# Altium schematic sheet micron_P7.SchDoc
size A; SheetNumber: 7; SheetTotal: 11
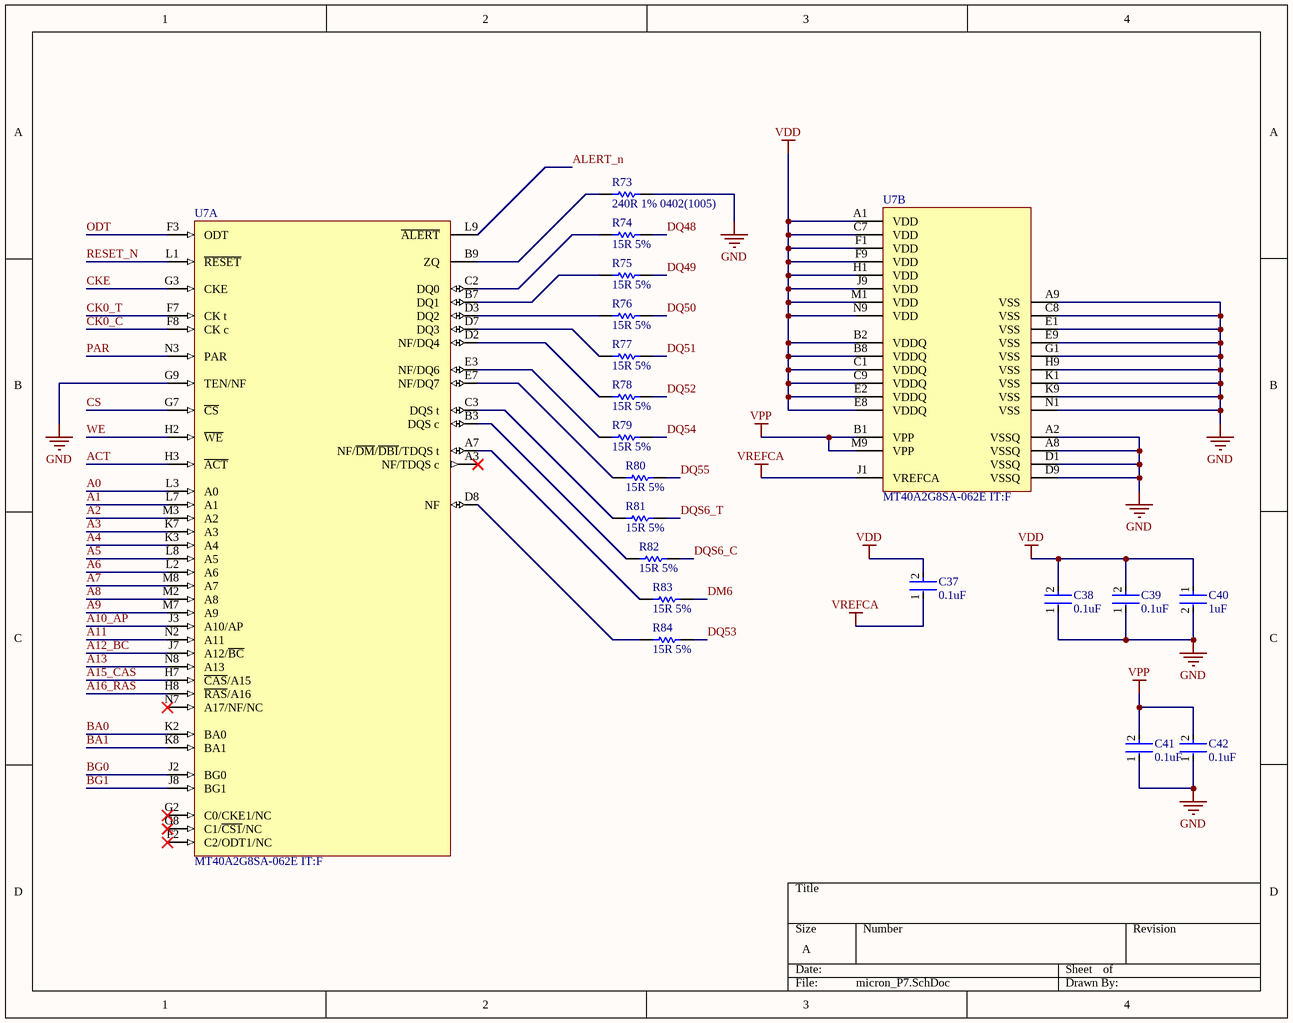
[diagram p0: micron_P7.SchDoc]

## Parts
C37  0.1uF  [FP-GRM15-MFG]
C38  0.1uF  [FP-GRM15-MFG]
C39  0.1uF  [FP-GRM15-MFG]
C40  1uF  [FP-CL511-IPC_C]
C41  0.1uF  [FP-GRM15-MFG]
C42  0.1uF  [FP-GRM15-MFG]
R73  240R 1% 0402(1005)  [RESC0402(1005)_L]
R74  15R 5%  [RESC1005X40X25LL05T10]
R75  15R 5%  [RESC1005X40X25LL05T10]
R76  15R 5%  [RESC1005X40X25LL05T10]
R77  15R 5%  [RESC1005X40X25LL05T10]
R78  15R 5%  [RESC1005X40X25LL05T10]
R79  15R 5%  [RESC1005X40X25LL05T10]
R80  15R 5%  [RESC1005X40X25LL05T10]
R81  15R 5%  [RESC1005X40X25LL05T10]
R82  15R 5%  [RESC1005X40X25LL05T10]
R83  15R 5%  [RESC1005X40X25LL05T10]
R84  15R 5%  [RESC1005X40X25LL05T10]
U7  MT40A2G8SA-062E IT:F  [SA_MFG]  (parts A,B of 2)

## Nets
GND: C38.1 C39.1 C40.2 C41.1 C42.1 R73.2 U7.A2(VSSQ) U7.A8(VSSQ) U7.A9(VSS) U7.C8(VSS) U7.D1(VSSQ) U7.D9(VSSQ) U7.E1(VSS) U7.E9(VSS) U7.G1(VSS) U7.G9(TEN/NF) U7.H9(VSS) U7.K1(VSS) U7.K9(VSS) U7.N1(VSS)
VDD: C37.2 C38.2 C39.2 C40.1 U7.A1(VDD) U7.B2(VDDQ) U7.B8(VDDQ) U7.C1(VDDQ) U7.C7(VDD) U7.C9(VDDQ) U7.E2(VDDQ) U7.E8(VDDQ) U7.F1(VDD) U7.F9(VDD) U7.H1(VDD) U7.J9(VDD) U7.M1(VDD) U7.N9(VDD)
VPP: C41.2 C42.2 U7.B1(VPP) U7.M9(VPP)
VREFCA: C37.1 U7.J1(VREFCA)
A0: U7.L3(A0)
A1: U7.L7(A1)
A2: U7.M3(A2)
A3: U7.K7(A3)
A4: U7.K3(A4)
A5: U7.L8(A5)
A6: U7.L2(A6)
A7: U7.M8(A7)
A8: U7.M2(A8)
A9: U7.M7(A9)
A10_AP: U7.J3(A10/AP)
A11: U7.N2(A11)
A12_BC: U7.J7(A12/~{BC})
A13: U7.N8(A13)
A15_CAS: U7.H7(~{CAS}/A15)
A16_RAS: U7.H8(~{RAS}/A16)
ACT: U7.H3(~{ACT})
ALERT_n: U7.L9(~{ALERT})
BA0: U7.K2(BA0)
BA1: U7.K8(BA1)
BG0: U7.J2(BG0)
BG1: U7.J8(BG1)
CK0_C: U7.F8(CK_c)
CK0_T: U7.F7(CK_t)
CKE: U7.G3(CKE)
CS: U7.G7(~{CS})
DM6: R83.2
DQ48: R74.2
DQ49: R75.2
DQ50: R76.2
DQ51: R77.2
DQ52: R78.2
DQ53: R84.2
DQ54: R79.2
DQ55: R80.2
DQS6_C: R82.2
DQS6_T: R81.2
ODT: U7.F3(ODT)
PAR: U7.N3(PAR)
RESET_N: U7.L1(~{RESET})
WE: U7.H2(~{WE})
NetR73_1: R73.1 U7.B9(ZQ)
NetR74_1: R74.1 U7.C2(DQ0)
NetR75_1: R75.1 U7.B7(DQ1)
NetR76_1: R76.1 U7.D3(DQ2)
NetR77_1: R77.1 U7.D7(DQ3)
NetR78_1: R78.1 U7.D2(NF/DQ4)
NetR79_1: R79.1 U7.E3(NF/DQ6)
NetR80_1: R80.1 U7.E7(NF/DQ7)
NetR81_1: R81.1 U7.C3(DQS_t)
NetR82_1: R82.1 U7.B3(DQS_c)
NetR83_1: R83.1 U7.A7(NF/~{DM}/~{DBI}/TDQS_t)
NetR84_1: R84.1 U7.D8(NF)

Not connected (* = marked no-connect by the designer): U7 A3(NF/TDQS_c)* F2(C2/ODT1/NC)* G2(C0/CKE1/NC)* G8(C1/~{CS1}/NC)* N7(A17/NF/NC)*

## Library data of the parts
C37-C39 C41 C42 = CMP-2100-03641-2: CAP CER 0.1UF 16V X7R 0402; Manufacturer Part Number: GRM155R71C104KA88D; Manufacturer: Murata; Standoff Height: 0mm; Tolerance: 10%; Voltage Rating: 16Vdc; Material: Ceramic; Capacitance: 0.10μF; Value: 0.10μF; RoHS: TRUE; Temperature Characteristic: X7R; Octopart: https://octopart.com/grm155r71c104ka88d-murata-196880; Digikey Description: CAP CER 0.1UF 16V X7R 0402; Device Class L3: Ceramic Capacitors; Height: 0.55mm; ComponentLink2Description: Datasheet; Temperature Range Low: -55°C; Ipc Land Pattern Name: CAPC10050X219; ComponentLink2URL: https://search.murata.co.jp/Ceramy/image/img/A01X/G101/ENG/GRM155R71H471KA01-01A.pdf; Device Class L1: Passive Components; Lead Free: yes; Category: Cap; Package: GRM15; Temperature: -55°C to +125°C; Device Class L2: Capacitors; Temperature Range High: +125°C; Mouser Description: 0402 0.1 uF 16V ±10 % Tolerance X7R SMT Multilayer Ceramic Capacitor
C40 = CMP-13271-001936-1: Cap Ceramic 1uF 10V X5R ±10% SMD 0402 +85°C Paper T/R; Depth: 0.5mm; Case Code (Imperial): 0402; Material: Ceramic; Mount: Surface Mount; Thickness: 0.022inch; Dielectric: X5R; Capacitance: 1uF; Radiation Hardening: No; Case/Package: 0402; Length: 1mm; Tolerance: 10%; Max Operating Temperature: 85°C; Package Quantity: 1; Width: 0.02inch; Voltage Rating: 10V; Contact Plating: Tin; Height: 0.5mm; Min Operating Temperature: -55°C; Case Code (Metric): 1005; Packaging: Tape and Reel
R73 = CMP-1011-00438-1: 240R 0.063W 1% 0402 (1005 Metric)  SMD; Case-Metric: 1005; Case-EIA: 0402; Value: 240.00 Ohm; Power: 0.063 W; Tolerance: 1 %; Technology: SMT
R74-R84 = CMP-2002-07413-1: Manufacturer: Yageo / Phycomp; Part Number: RC0402FR-0715RL
U7 = CMP-00526-125391410-1: DRAMChip DDR4 SDRAM 16Gbit 2Gx8 1.2V 78-Pin FBGA Tray; ComponentLink1URL: http://www.micron.com/; ComponentLink3Description: Manufacturer's Package Drawing; ComponentLink2Description: Datasheet URL; ComponentLink1Description: Manufacturer's Website; ComponentLink3URL: https://www.micron.com/content/dam/micron/global/public/products/customer-service-note/csn33-bga-user-guide.pdf; HelpURL: https://4donline.ihs.com/images/VipMasterIC/IC/MICT/MICT-S-A0014105731/MICT-S-A0014105731-1.pdf?hkey=6D3A4C79FDBF58556ACFDE234799DDF0; ComponentLink2URL: https://4donline.ihs.com/images/VipMasterIC/IC/MICT/MICT-S-A0014105731/MICT-S-A0014105731-1.pdf?hkey=6D3A4C79FDBF58556ACFDE234799DDF0